# Altium schematic sheet ArcadeRpiSmartShield 33 Pi interface.SchDoc: R Pi interface circuitry
size A4; DocumentNumber: 2; SheetNumber: 2; SheetTotal: 2; VersionControl_RevNumber: 1
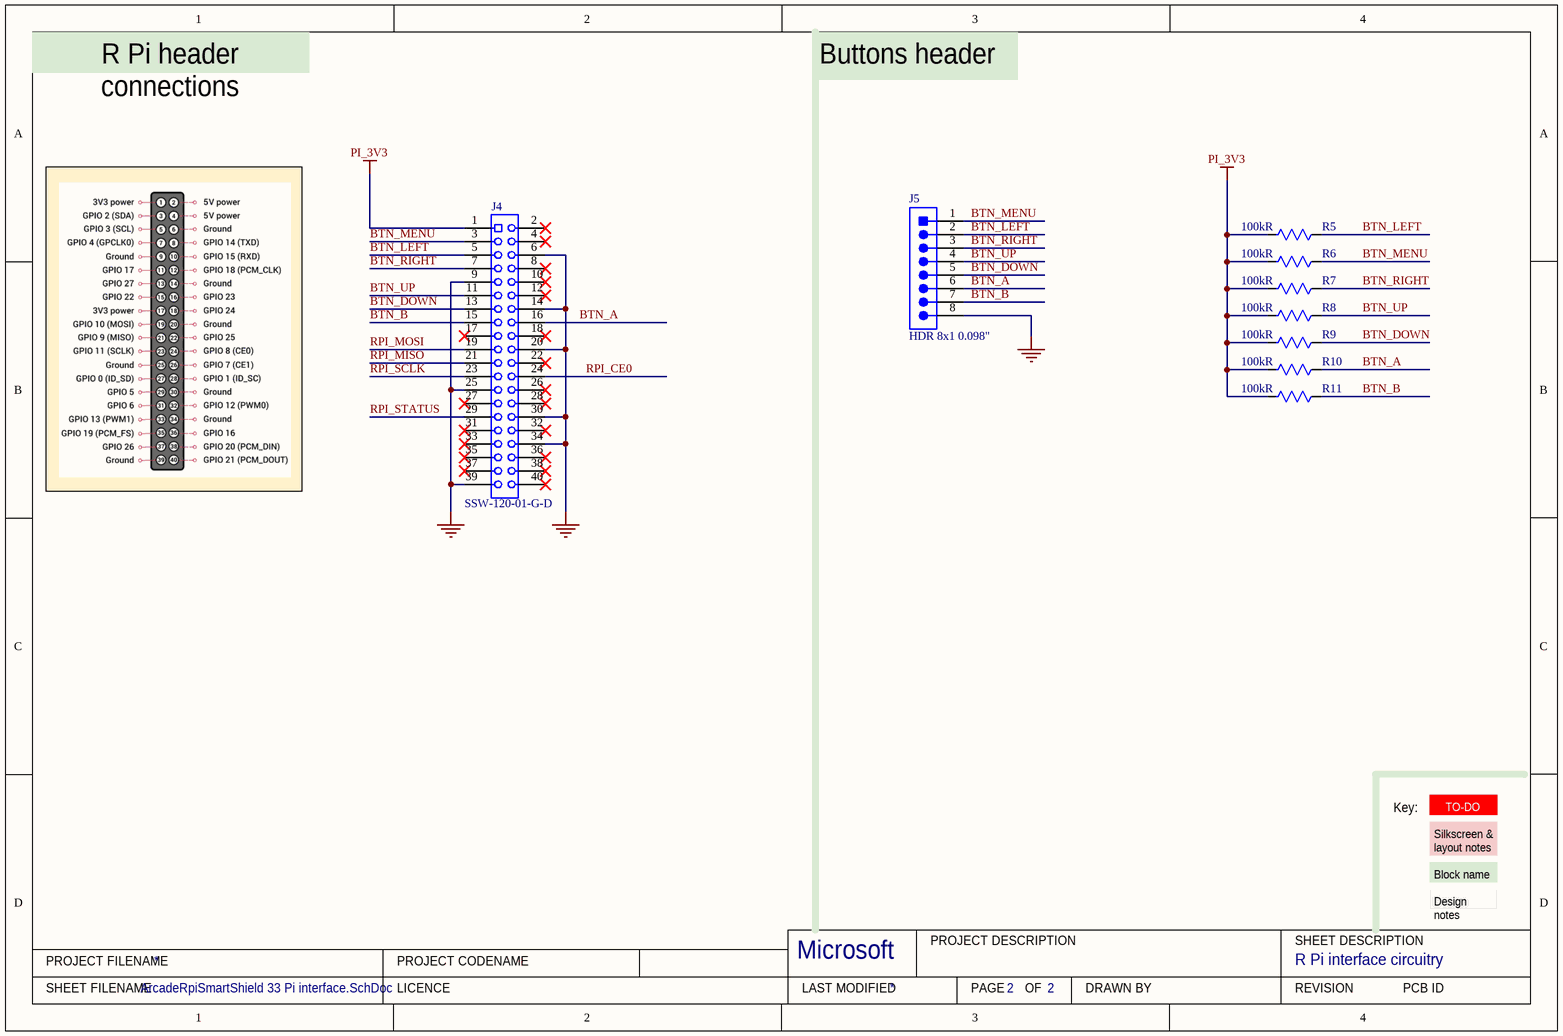
[diagram p0: ArcadeRpiSmartShield 33 Pi interface.SchDoc]

## Parts
J4  SSW-120-01-G-D  [SAMTEC-SSW-120-01-G-D]
J5  HDR 8x1 0.098"  [B8B-XH-A(LF)(SN)]
R5  Resistance: 100kR  [R0402 - Without outline]  (hidden comment: RC0402FR-07100KL)
R6  Resistance: 100kR  [R0402 - Without outline]  (hidden comment: RC0402FR-07100KL)
R7  Resistance: 100kR  [R0402 - Without outline]  (hidden comment: RC0402FR-07100KL)
R8  Resistance: 100kR  [R0402 - Without outline]  (hidden comment: RC0402FR-07100KL)
R9  Resistance: 100kR  [R0402 - Without outline]  (hidden comment: RC0402FR-07100KL)
R10  Resistance: 100kR  [R0402 - Without outline]  (hidden comment: RC0402FR-07100KL)
R11  Resistance: 100kR  [R0402 - Without outline]  (hidden comment: RC0402FR-07100KL)

## Nets
GND: J4.6 J4.9 J4.14 J4.20 J4.25 J4.30 J4.34 J4.39 J5.8
PI_3V3: J4.1 R5.1 R6.1 R7.1 R8.1 R9.1 R10.1 R11.1
BTN_A: J4.16 J5.6 R10.2
BTN_B: J4.15 J5.7 R11.2
BTN_DOWN: J4.13 J5.5 R9.2
BTN_LEFT: J4.5 J5.2 R5.2
BTN_MENU: J4.3 J5.1 R6.2
BTN_RIGHT: J4.7 J5.3 R7.2
BTN_UP: J4.11 J5.4 R8.2
RPI_CE0: J4.24
RPI_MISO: J4.21
RPI_MOSI: J4.19
RPI_SCLK: J4.23
RPI_STATUS: J4.29

Not connected (* = marked no-connect by the designer): J4 2* 4* 8* 10* 12* 17* 18* 22* 26* 27* 28* 31* 32* 33* 35* 36* 37* 38* 40*

## Notes on the sheet
- R Pi header connections
- Buttons header
- Key:
- TO-DO
- Silkscreen & layout notes
- Block name
- Design notes
- PROJECT FILENAME
- PROJECT CODENAME
- Microsoft
- PROJECT DESCRIPTION
- SHEET DESCRIPTION
- SHEET FILENAME
- LICENCE
- LAST MODIFIED
- PAGE
- OF
- DRAWN BY
- REVISION
- PCB ID

## Library data of the parts
J4 = SSW-120-01-G-D: 20 position 2 row (40 way) 0.1" TH socket; Manufacturer: Samtec; Number of Contacts: 40; Gender: Receptacle; Connector Type: Receptacle,Socket; Contact Resistance: 10mR; Max Current Rating: 6.9A; Max Voltage Rating (AC): 550V; Mating Cycles: 100; Pitch: 2.54mm; Row Spacing: 0.1inch; ComponentLink1Description: samtec catalogue page online; ComponentLink1URL: http://suddendocs.samtec.com/catalog_english/ssw_th.pdf; ComponentLink2Description: samtec drawing online; ComponentLink2URL: http://suddendocs.samtec.com/prints/ssw-1xx-xx-xxx-x-xx-xxx-xx-mkt.pdf; Supplier 1: Digi-Key; Manufacturer Part Number: SSW-120-01-G-D; Stock 1: 0; Pricing 1: 1=5.36000, 10=5.14900, 25=4.72040, 50=4.50580, 100=4.29120, 250=3.75480, 500=3.64752 (USD); RoHS: Yes; Mount: Through Hole; Contact Plating: Gold; Color: Black; Contact Material: Bronze; Housing Color: Black; Housing Material: Polymer; Min Operating Temperature: -55°C; Max Operating Temperature: 125°C; Number of Rows: 2; Termination: Solder; Packaging: Bulk; Number of Positions: 40; Orientation: Straight; Current Rating: 6.9A; Voltage Rating: 550V; Length: 51.31mm; Depth: 4.95mm; Lead Pitch: 2.54mm; Radiation Hardening: No; Lead Free: Lead Free; REACH SVHC: No SVHC; Supplier 2: Farnell; Supplier 3: Mouser; Supplier 4: RSComponents; Supplier Part Number 1: SAM1208-20-ND; Supplier Part Number 2: 1668397; Supplier Part Number 3: 200-SSW12001GD; Supplier Part Number 4: 7655802
J5 = B8B-XH-A(LF)(SN): CONN HEADER VERT 8POS 2.5MM; Manufacturer: JST; Number of Positions: 8; Current Rating: 3A; Connector Type: Male Pin; Max Voltage Rating (AC): 250V; Insulation Resistance: 1GR; Contact Resistance: 20mR; Wire/Cable Gauge: 22AWG; Supplier 1: Digi-Key; Manufacturer Part Number: B8B-XH-A(LF)(SN); RoHS: Yes; Category: FFC / FPC; Stock 1: 6017; Pricing 1: 1=0.360000, 10=0.341000, 100=0.238700, 500=0.204580, 1000=0.170480, 5000=0.146130, 10000=0.136390 (USD); Mount: Through Hole; Color: Natural; Contact Material: Brass; Contact Plating: Tin,Copper,Lead; Housing Color: White; Housing Material: Polyamide; Min Operating Temperature: -25°C; Max Operating Temperature: 85°C; Packaging: Bulk; Termination: Press-Fit; Number of Rows: 1; Orientation: Straight; Fastening Type: Detent; Number of Contacts: 8; Max Current Rating: 3A; Voltage Rating (AC): 250V; Voltage Rating: 250V; Length: 22.4mm; Pitch: 2.5mm; Depth: 5.75mm; Lead Pitch: 2.5mm; REACH SVHC: No SVHC; Lead Free: Lead Free; ComponentLink1URL: https://datasheet.ciiva.com/26894/getdatasheetpartid-440408-26894817.pdf; ComponentLink1Description: Online datasheet; Supplier 2: Farnell; Stock 2: 11541; Pricing 2: 10=0.27000, 100=0.18800, 500=0.16200, 1000=0.13500, 2500=0.12500, 5000=0.11500 (GBP); Supplier Part Number 1: 455-2251-ND; Supplier Part Number 2: 1516284; Created By: D. Gakure; Checked By: ?
R5-R11 = RC0402FR-07100KL: RES SMD 100K OHM 1% 1/16W 0402; Manufacturer: Yageo; Temperature Coefficient: 100ppm/°C; Power Rating: 63mW; Voltage Rating: 50V; Supplier 1: Digi-Key; Manufacturer Part Number: RC0402FR-07100KL; RoHS: Yes; Category: Resistors; Stock 1: 5819191; Pricing 1: 1=0.10000, 10=0.01400, 100=0.00580, 1000=0.00262, 2500=0.00228, 5000=0.00188 (USD); Case Code (Metric): 1005; Case Code (Imperial): 0402; Min Operating Temperature: -55°C; Max Operating Temperature: 155°C; Resistor Type: Thick Film; Packaging: Tape and Reel; Package Quantity: 1; Number of Terminations: 2; Termination: SMD/SMT; Max Power Dissipation: 63mW; Working Voltage: 50V; Features: Moisture Resistant; Length: 0.039inch; Height: 0.016inch; Width: 0.02inch; Depth: 0.5mm; REACH SVHC: No SVHC; Lead Free: Lead Free; Military Standard: Not; ComponentLink2URL: https://datasheet.ciiva.com/2453/pyu-r-int-thick-7-2453361.pdf; ComponentLink2Description: Online datasheet; Supplier 2: Mouser; Stock 2: 4458847; Pricing 2: 1=0.10000, 10=0.01200, 100=0.00400, 1000=0.00400, 2500=0.00400, 10000=0.00300 (USD); Supplier 3: Farnell; Stock 3: 19392; Pricing 3: 1=0.10200, 25=0.01220, 100=0.01200, 250=0.01020, 500=0.00890 (GBP); Created By: DG; Checked By: ?; Supplier Part Number 3: 2131798; Supplier Part Number 1: 311-100KLRCT-ND; Supplier Part Number 2: 603-RC0402FR-07100KL; Tolerance: 1%; Case/Package: 0402